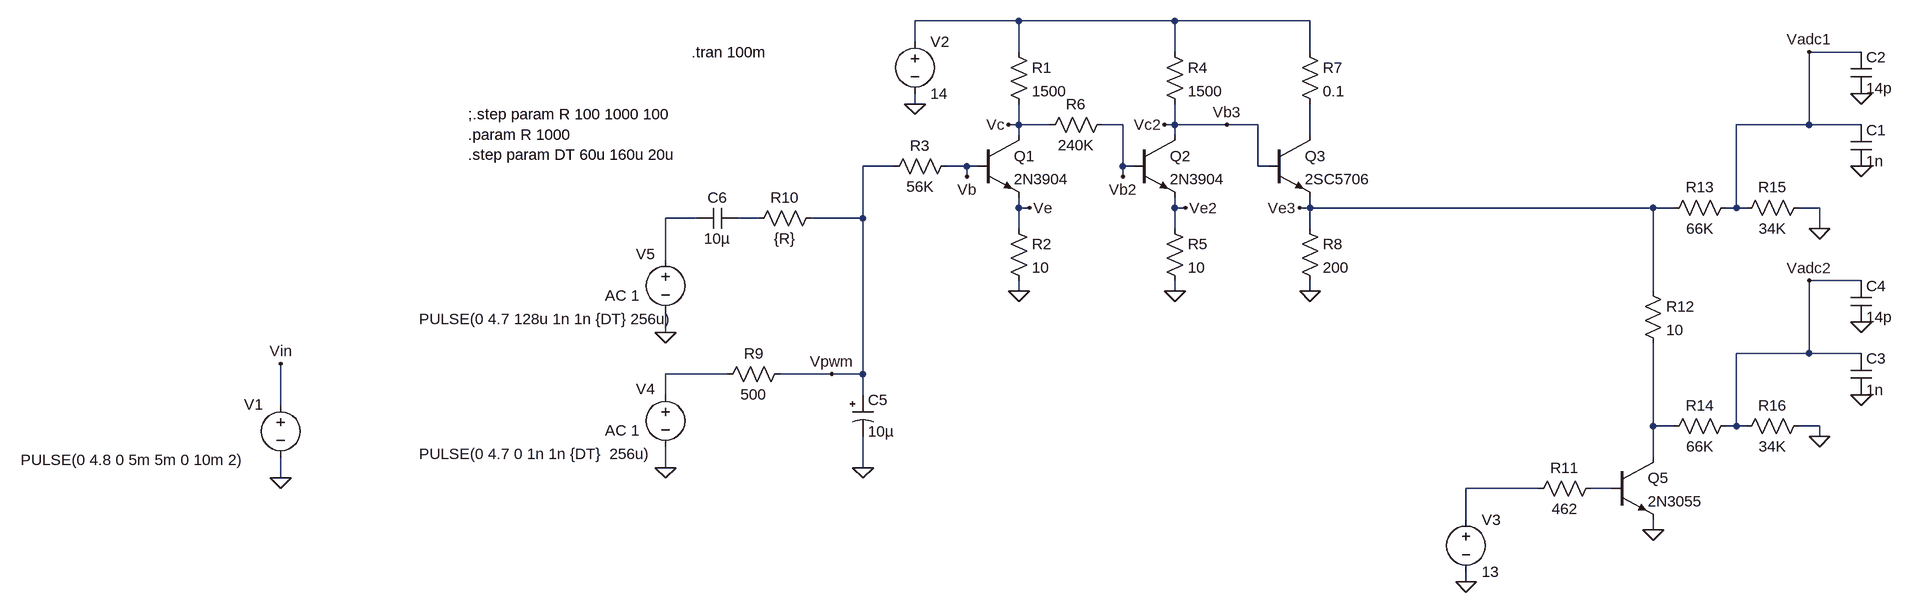
[diagram p0: schematic 2N3904 DC Amplifier - Collector Driver (10mA with Neg Feedback).asc]
2N3904 DC Amplifier - Collector Driver (10mA with Neg Feedback).asc, the LTspice schematic file:
Version 4
SHEET 1 2760 912
WIRE 192 -48 32 -48
WIRE 432 -48 192 -48
WIRE 640 -48 432 -48
WIRE 32 -16 32 -48
WIRE 192 0 192 -48
WIRE 432 0 432 -48
WIRE 640 0 640 -48
WIRE 1488 0 1408 0
WIRE 32 80 32 64
WIRE 192 112 192 80
WIRE 192 112 176 112
WIRE 240 112 192 112
WIRE 352 112 320 112
WIRE 432 112 432 80
WIRE 432 112 416 112
WIRE 512 112 432 112
WIRE 560 112 512 112
WIRE 1408 112 1408 0
WIRE 1408 112 1296 112
WIRE 1488 112 1408 112
WIRE 192 128 192 112
WIRE 432 128 432 112
WIRE 640 128 640 80
WIRE 0 176 -48 176
WIRE 112 176 80 176
WIRE 128 176 112 176
WIRE 352 176 352 112
WIRE 368 176 352 176
WIRE 560 176 560 112
WIRE 576 176 560 176
WIRE 112 192 112 176
WIRE 352 192 352 176
WIRE 192 240 192 224
WIRE 208 240 192 240
WIRE 432 240 432 224
WIRE 448 240 432 240
WIRE 640 240 640 224
WIRE 640 240 624 240
WIRE 1168 240 640 240
WIRE 1200 240 1168 240
WIRE 1296 240 1296 112
WIRE 1296 240 1280 240
WIRE 1312 240 1296 240
WIRE 1424 240 1392 240
WIRE -304 256 -352 256
WIRE -208 256 -240 256
WIRE -48 256 -48 176
WIRE -48 256 -128 256
WIRE 192 272 192 240
WIRE 432 272 432 240
WIRE 640 272 640 240
WIRE 1424 272 1424 240
WIRE -352 320 -352 256
WIRE 1488 352 1408 352
WIRE 192 368 192 352
WIRE 432 368 432 352
WIRE 640 368 640 352
WIRE 1168 368 1168 240
WIRE -352 432 -352 400
WIRE 1408 464 1408 352
WIRE 1408 464 1296 464
WIRE 1488 464 1408 464
WIRE -256 496 -352 496
WIRE -96 496 -176 496
WIRE -48 496 -48 256
WIRE -48 496 -96 496
WIRE -352 528 -352 496
WIRE -48 528 -48 496
WIRE -944 544 -944 480
WIRE 1168 576 1168 448
WIRE 1200 576 1168 576
WIRE 1296 576 1296 464
WIRE 1296 576 1280 576
WIRE 1312 576 1296 576
WIRE 1424 576 1392 576
WIRE 1424 592 1424 576
WIRE 1168 624 1168 576
WIRE -352 640 -352 608
WIRE -48 640 -48 592
WIRE -944 656 -944 624
WIRE 992 672 880 672
WIRE 1104 672 1072 672
WIRE 880 720 880 672
WIRE 1168 736 1168 720
WIRE 880 816 880 800
FLAG 32 80 0
FLAG -944 656 0
FLAG 192 368 0
FLAG 176 112 Vc
FLAG 208 240 Ve
FLAG 112 192 Vb
FLAG -944 480 Vin
FLAG 432 368 0
FLAG 416 112 Vc2
FLAG 448 240 Ve2
FLAG 352 192 Vb2
FLAG 640 368 0
FLAG 624 240 Ve3
FLAG 512 112 Vb3
FLAG 1168 736 0
FLAG 1424 272 0
FLAG 1424 592 0
FLAG 1488 176 0
FLAG 1488 64 0
FLAG 1488 528 0
FLAG 1488 416 0
FLAG 1408 0 Vadc1
FLAG 1408 352 Vadc2
FLAG 880 816 0
FLAG -352 640 0
FLAG -48 640 0
FLAG -96 496 Vpwm
FLAG -352 432 0
SYMBOL npn 128 128 R0
SYMATTR InstName Q1
SYMATTR Value 2N3904
SYMBOL voltage -944 528 R0
WINDOW 0 -56 15 Left 2
WINDOW 3 -400 100 Left 2
WINDOW 123 -382 125 Left 2
WINDOW 39 0 0 Left 0
SYMATTR InstName V1
SYMATTR Value PULSE(0 4.8 0 5m 5m 0 10m 2)
SYMBOL voltage 32 -32 R0
WINDOW 123 0 0 Left 0
WINDOW 39 0 0 Left 0
SYMATTR InstName V2
SYMATTR Value 14
SYMBOL res 176 -16 R0
SYMATTR InstName R1
SYMATTR Value 1500
SYMBOL res 96 160 R90
WINDOW 0 0 56 VBottom 2
WINDOW 3 32 56 VTop 2
SYMATTR InstName R3
SYMATTR Value 56K
SYMBOL res 176 256 R0
SYMATTR InstName R2
SYMATTR Value 10
SYMBOL npn 368 128 R0
SYMATTR InstName Q2
SYMATTR Value 2N3904
SYMBOL res 416 -16 R0
SYMATTR InstName R4
SYMATTR Value 1500
SYMBOL res 416 256 R0
SYMATTR InstName R5
SYMATTR Value 10
SYMBOL res 336 96 R90
WINDOW 0 0 56 VBottom 2
WINDOW 3 32 56 VTop 2
SYMATTR InstName R6
SYMATTR Value 240K
SYMBOL npn 576 128 R0
SYMATTR InstName Q3
SYMATTR Value 2SC5706
SYMBOL res 624 -16 R0
SYMATTR InstName R7
SYMATTR Value 0.1
SYMBOL res 624 256 R0
SYMATTR InstName R8
SYMATTR Value 200
SYMBOL res 1088 656 R90
WINDOW 0 0 56 VBottom 2
WINDOW 3 32 56 VTop 2
SYMATTR InstName R11
SYMATTR Value 462
SYMBOL npn 1104 624 R0
SYMATTR InstName Q5
SYMATTR Value 2N3055
SYMBOL res 1152 352 R0
SYMATTR InstName R12
SYMATTR Value 10
SYMBOL res 1184 256 R270
WINDOW 0 32 56 VTop 2
WINDOW 3 0 56 VBottom 2
SYMATTR InstName R13
SYMATTR Value 66K
SYMBOL res 1184 592 R270
WINDOW 3 0 56 VBottom 2
WINDOW 0 32 56 VTop 2
SYMATTR Value 66K
SYMATTR InstName R14
SYMBOL res 1296 256 R270
WINDOW 0 32 56 VTop 2
WINDOW 3 0 56 VBottom 2
SYMATTR InstName R15
SYMATTR Value 34K
SYMBOL res 1296 592 R270
WINDOW 3 0 56 VBottom 2
WINDOW 0 32 56 VTop 2
SYMATTR Value 34K
SYMATTR InstName R16
SYMBOL cap 1472 112 R0
SYMATTR InstName C1
SYMATTR Value 1n
SYMBOL cap 1472 0 R0
SYMATTR InstName C2
SYMATTR Value 14p
SYMBOL cap 1472 464 R0
SYMATTR InstName C3
SYMATTR Value 1n
SYMBOL cap 1472 352 R0
SYMATTR InstName C4
SYMATTR Value 14p
SYMBOL voltage 880 704 R0
WINDOW 123 0 0 Left 0
WINDOW 39 0 0 Left 0
SYMATTR InstName V3
SYMATTR Value 13
SYMBOL res -160 480 R90
WINDOW 0 0 56 VBottom 2
WINDOW 3 32 56 VTop 2
SYMATTR InstName R9
SYMATTR Value 500
SYMBOL voltage -352 512 R0
WINDOW 0 -45 7 Left 2
WINDOW 3 -379 107 Left 2
WINDOW 123 -93 71 Left 2
WINDOW 39 0 0 Left 2
SYMATTR InstName V4
SYMATTR Value PULSE(0 4.7 0 1n 1n {DT}  256u)
SYMATTR Value2 AC 1
SYMBOL polcap -64 528 R0
WINDOW 3 24 56 Left 2
SYMATTR Value 10µ
SYMATTR InstName C5
SYMATTR Description Capacitor
SYMATTR Type cap
SYMATTR SpiceLine V=50 Irms=25m Rser=6.7 Lser=0
SYMBOL voltage -352 304 R0
WINDOW 0 -45 7 Left 2
WINDOW 3 -379 107 Left 2
WINDOW 123 -93 71 Left 2
WINDOW 39 0 0 Left 2
SYMATTR InstName V5
SYMATTR Value PULSE(0 4.7 128u 1n 1n {DT} 256u)
SYMATTR Value2 AC 1
SYMBOL res -112 240 R90
WINDOW 0 0 56 VBottom 2
WINDOW 3 32 56 VTop 2
SYMATTR InstName R10
SYMATTR Value {R}
SYMBOL cap -240 240 R90
WINDOW 0 0 32 VBottom 2
WINDOW 3 32 32 VTop 2
SYMATTR InstName C6
SYMATTR Value 10µ
TEXT -312 0 Left 2 !.tran 100m
TEXT -656 96 Left 2 !;.step param R 100 1000 100\n.param R 1000\n.step param DT 60u 160u 20u

The netlist it stands for:
* 2N3904 DC Amplifier - Collector Driver (10mA with Neg Feedback).asc
Q1 Vc Vb Ve 0 2N3904
V1 Vin 0 PULSE(0 4.8 0 5m 5m 0 10m 2)
V2 N001 0 14
R1 N001 Vc 1500
R3 Vb Vpwm 56K
R2 Ve 0 10
Q2 Vb3 Vb2 Ve2 0 2N3904
R4 N001 Vb3 1500
R5 Ve2 0 10
R6 Vb2 Vc 240K
Q3 N002 Vb3 Ve3 0 2SC5706
R7 N001 N002 0.1
R8 Ve3 0 200
R11 N008 N007 462
Q5 N006 N008 0 0 2N3055
R12 Ve3 N006 10
R13 Ve3 Vadc1 66K
R14 N006 Vadc2 66K
R15 Vadc1 0 34K
R16 Vadc2 0 34K
C1 Vadc1 0 1n
C2 Vadc1 0 14p
C3 Vadc2 0 1n
C4 Vadc2 0 14p
V3 N007 0 13
R9 Vpwm N005 500
V4 N005 0 PULSE(0 4.7 0 1n 1n {DT}  256u) AC 1
C5 Vpwm 0 10µ V=50 Irms=25m Rser=6.7 Lser=0
V5 N003 0 PULSE(0 4.7 128u 1n 1n {DT} 256u) AC 1
R10 Vpwm N004 {R}
C6 N004 N003 10µ
.model NPN NPN
.model PNP PNP
.lib standard.bjt
.tran 100m
;.step param R 100 1000 100
.param R 1000
.step param DT 60u 160u 20u
.backanno
.end